# Altium schematic sheet Power.SchDoc
size A4; SheetNumber: 1; SheetTotal: 8
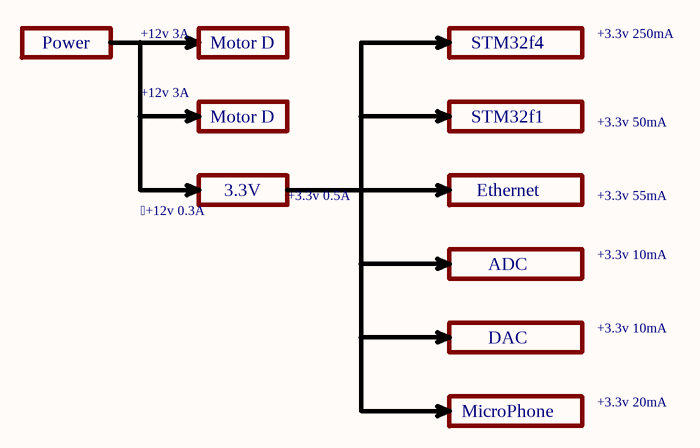
[diagram p0: Power.SchDoc]

## Notes on the sheet
- Power
- +12v 3A
- Motor D
- STM32f4
- +3.3v 250mA
- STM32f1
- +3.3v 50mA
- 3.3V
- +3.3v 0.5A
- Ethernet
- +3.3v 55mA
- +12v 0.3A
- ADC
- +3.3v 10mA
- DAC
- MicroPhone
- +3.3v 20mA